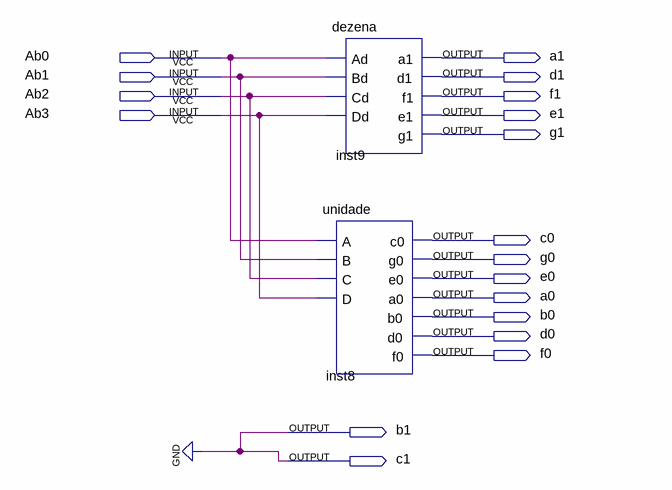
[diagram p0: schematic sheet]
// Quartus schematic decoder.bdf as structural Verilog: 2 symbols, 18 pins
module decoder (
  input  Ab0,
  input  Ab1,
  input  Ab2,
  input  Ab3,
  output a1,
  output d1,
  output f1,
  output e1,
  output g1,
  output c0,
  output g0,
  output e0,
  output a0,
  output b0,
  output d0,
  output f0,
  output b1,
  output c1
);

  dezena inst9 (.Ad(Ab0), .Bd(Ab1), .Cd(Ab2), .Dd(Ab3), .a1(a1), .d1(d1), .f1(f1), .e1(e1), .g1(g1));
  unidade inst8 (.A(Ab0), .B(Ab1), .C(Ab2), .D(Ab3), .c0(c0), .g0(g0), .e0(e0), .a0(a0), .b0(b0), .d0(d0), .f0(f0));

  assign b1 = 1'b0;
  assign c1 = 1'b0;
endmodule
